# Altium schematic sheet HT1017-MAIN.SchDoc
size A4
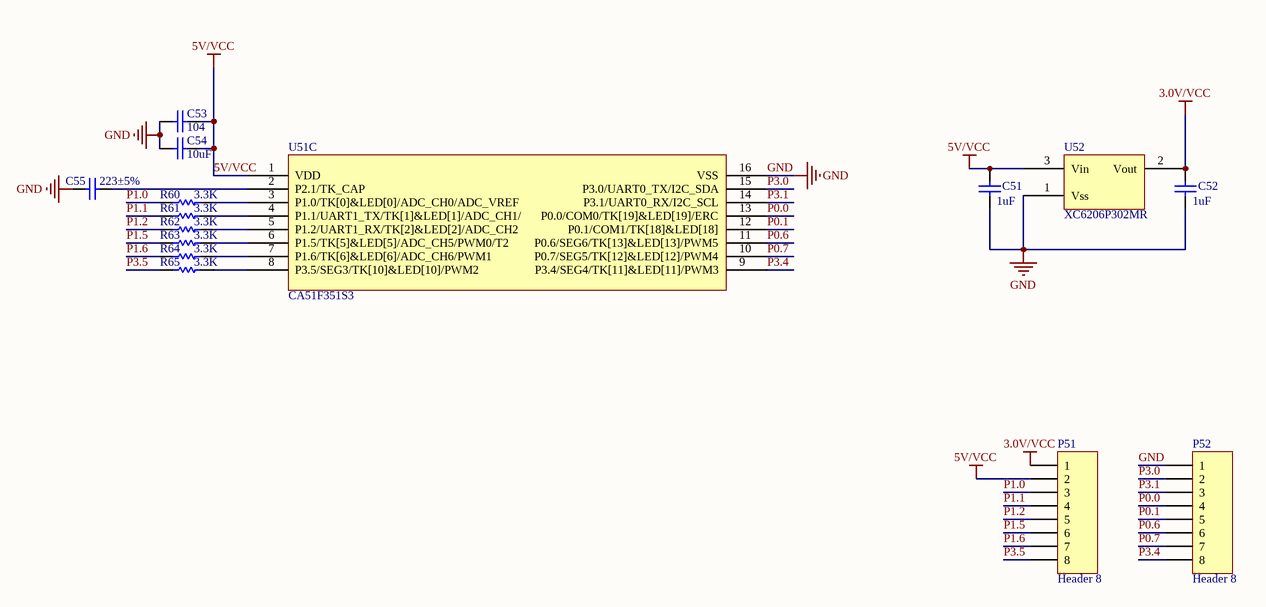
[diagram p0: HT1017-MAIN.SchDoc]

## Parts
C51  value 1uF  [C 0603_L]  (hidden comment: Cap)
C52  value 1uF  [C 0603_L]  (hidden comment: Cap)
C53  value 104  [C 0603_L]  (hidden comment: Cap)
C54  value 10uF  [C 0805_L]  (hidden comment: Cap)
C55  value 223±5%  [C 0603_L]  (hidden comment: Cap)
P51  Header 8  [HDR1X8]
P52  Header 8  [HDR1X8]
R60  value 3.3K  [R 0603_L]  (hidden comment: Res1)
R61  value 3.3K  [R 0603_L]  (hidden comment: Res1)
R62  value 3.3K  [R 0603_L]  (hidden comment: Res1)
R63  value 3.3K  [R 0603_L]  (hidden comment: Res1)
R64  value 3.3K  [R 0603_L]  (hidden comment: Res1)
R65  value 3.3K  [R 0603_L]  (hidden comment: Res1)
U51  CA51F351S3  [SOP16_L]  (part C of 3)
U52  XC6206P302MR  [SOT23-3L]

## Nets
3.0V/VCC: C52.2 P51.1 U52.2(Vout)
5V/VCC: C51.2 C53.2 C54.2 P51.2 U51.1(VDD) U52.3(Vin)
GND: C51.1 C52.1 C53.1 C54.1 C55.1 P52.1 U51.16(VSS) U52.1(Vss)
P0.0: P52.4 U51.13(P0.0/COM0/TK[19]&LED[19]/ERC)
P0.1: P52.5 U51.12(P0.1/COM1/TK[18]&LED[18])
P0.6: P52.6 U51.11(P0.6/SEG6/TK[13]&LED[13]/PWM5)
P0.7: P52.7 U51.10(P0.7/SEG5/TK[12]&LED[12]/PWM4)
P1.0: P51.3 R60.1
P1.1: P51.4 R61.1
P1.2: P51.5 R62.1
P1.5: P51.6 R63.1
P1.6: P51.7 R64.1
P3.0: P52.2 U51.15(P3.0/UART0_TX/I2C_SDA)
P3.1: P52.3 U51.14(P3.1/UART0_RX/I2C_SCL)
P3.4: P52.8 U51.9(P3.4/SEG4/TK[11]&LED[11]/PWM3)
P3.5: P51.8 R65.1
NetC55_2: C55.2 U51.2(P2.1/TK_CAP)
NetR60_2: R60.2 U51.3(P1.0/TK[0]&LED[0]/ADC_CH0/ADC_VREF)
NetR61_2: R61.2 U51.4(P1.1/UART1_TX/TK[1]&LED[1]/ADC_CH1/)
NetR62_2: R62.2 U51.5(P1.2/UART1_RX/TK[2]&LED[2]/ADC_CH2)
NetR63_2: R63.2 U51.6(P1.5/TK[5]&LED[5]/ADC_CH5/PWM0/T2)
NetR64_2: R64.2 U51.7(P1.6/TK[6]&LED[6]/ADC_CH6/PWM1)
NetR65_2: R65.2 U51.8(P3.5/SEG3/TK[10]&LED[10]/PWM2)

## Library data of the parts
C51-C55 = Cap: 电容; Published: 8-Jun-2000; LatestRevisionDate: 17-Jul-2002; LatestRevisionNote: Re-released for DXP Platform.; PackageReference: RAD-0.3; Publisher: Altium Limited; PackageDescription: Radial Cap, Thru-Hole; 2 Leads; 0.3 in Pin Spacing
P51 P52 = Header 8: Header, 8-Pin; LatestRevisionDate: 17-Jul-2002; LatestRevisionNote: Re-released for DXP Platform.; Publisher: Altium Limited
R60-R65 = Res1: 电阻; Published: 8-Jun-2000; LatestRevisionDate: 17-Jul-2002; LatestRevisionNote: Re-released for DXP Platform.; PackageReference: AXIAL-0.3; Publisher: Altium Limited; PackageDescription: Axial Device, Thru-Hole; 2 Leads; 0.3 in Pin Spacing
U52 = XC6206P302MR: 稳压IC